# EasyEDA schematic lab6_2020-12-28_17-34-32.json
TITLE: Sheet_1; REV: 1.0; Date: 2020-12-28; Sheet: 1/1; Drawn By: ersinalcinn; Company: Your Company
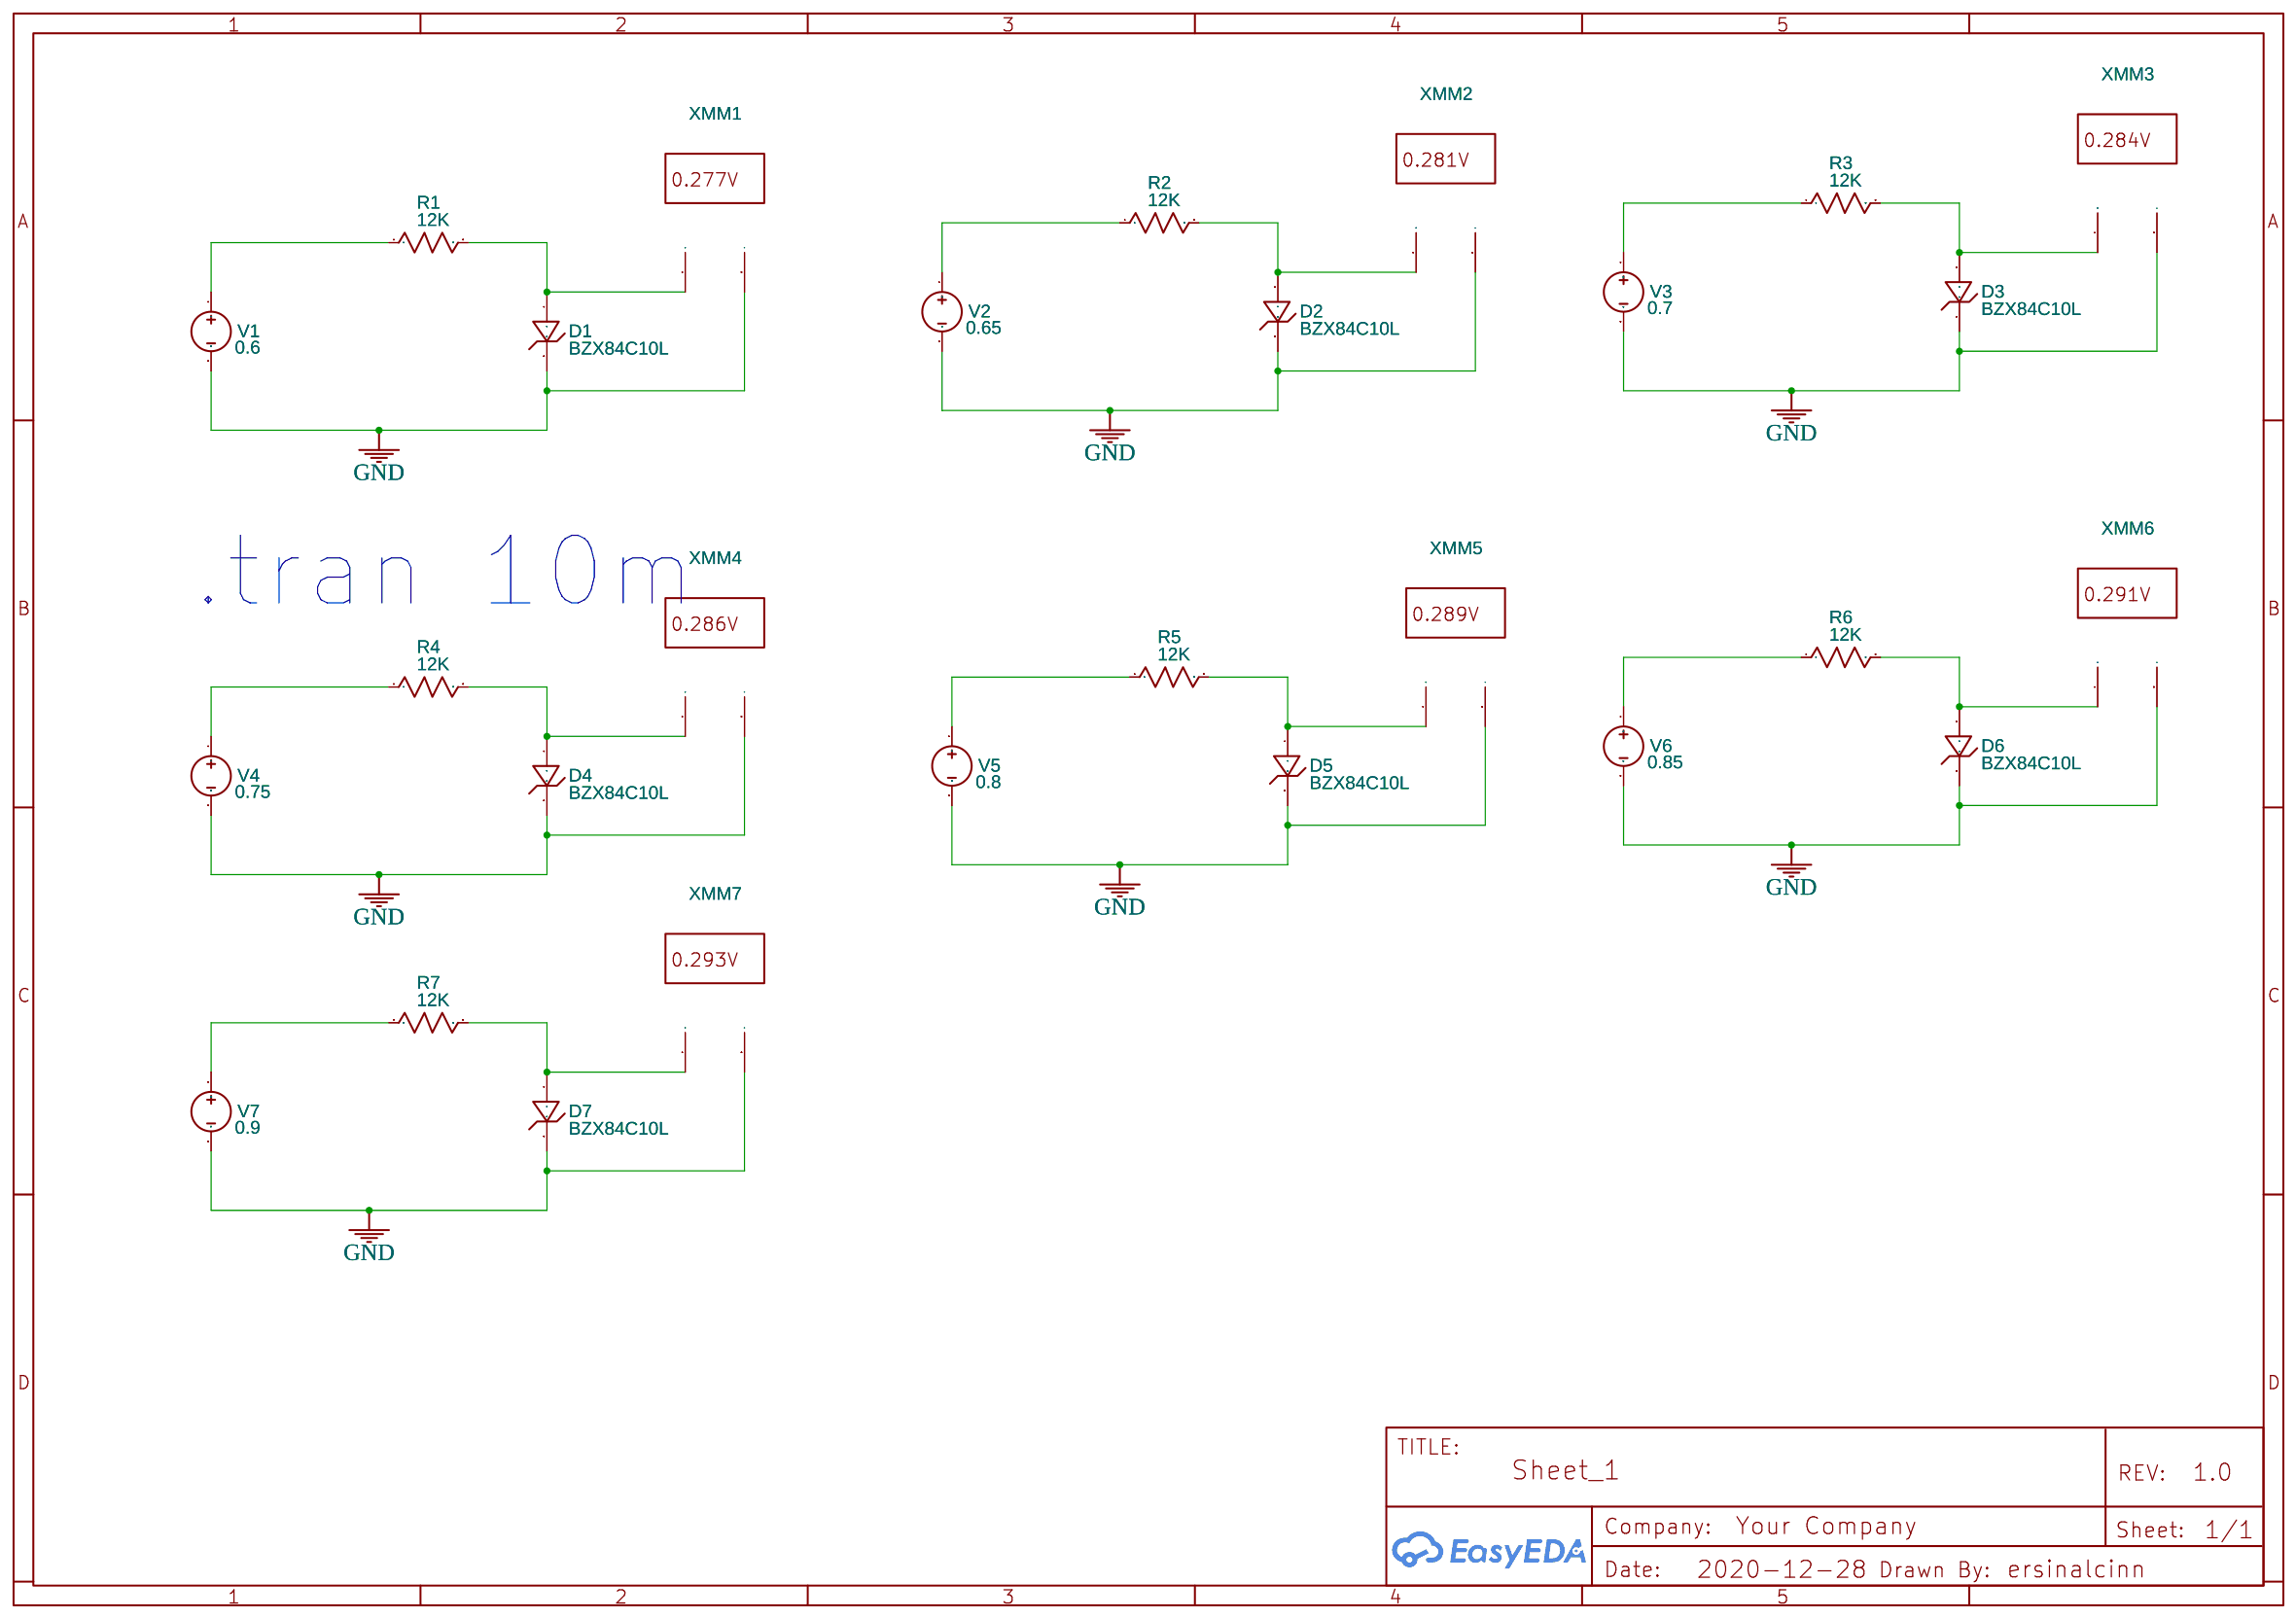
[diagram p0: schematic sheet]

## Parts
D1  BZX84C10L  [SMB]
D2  BZX84C10L  [SMB]
D3  BZX84C10L  [SMB]
D4  BZX84C10L  [SMB]
D5  BZX84C10L  [SMB]
D6  BZX84C10L  [SMB]
D7  BZX84C10L  [SMB]
R1  12K  [AXIAL-0.3]
R2  12K  [AXIAL-0.3]
R3  12K  [AXIAL-0.3]
R4  12K  [AXIAL-0.3]
R5  12K  [AXIAL-0.3]
R6  12K  [AXIAL-0.3]
R7  12K  [AXIAL-0.3]
V1  0.6  [HDR1X2]
V2  0.65  [HDR1X2]
V3  0.7  [HDR1X2]
V4  0.75  [HDR1X2]
V5  0.8  [HDR1X2]
V6  0.85  [HDR1X2]
V7  0.9  [HDR1X2]
XMM1  Multimeter
XMM2  Multimeter
XMM3  Multimeter
XMM4  Multimeter
XMM5  Multimeter
XMM6  Multimeter
XMM7  Multimeter

## Library data of the parts
D1-D7 = BZX84C10L: Contributor: EasyEDA
R1-R7 = Resistor_US: Resistance: 1k; Contributor: EasyEDA; Supplier: YUJING
V1-V7 = VDC: Contributor: EasyEDA; sim: true
XMM1-XMM7 = MULTIMETER: Supplier: LCSC; Multimeter Type: Voltmeter; Power Type: AC; Voltmeter resistance: 10μ; Ammeter resistance: 1G; NameDisplay: 0; Contributor: EasyEDA; sim: true

## Nets
GND: D1.2(K) D2.2(K) D3.2(K) D4.2(K) D5.2(K) D6.2(K) D7.2(K) V1.2 V2.2 V3.2 V4.2 V5.2 V6.2 V7.2 XMM1.2(I) XMM2.2(I) XMM3.2(I) XMM4.2(I) XMM5.2(I) XMM6.2(I) XMM7.2(I)
Net-(D1-1): D1.1(A) R1.2 XMM1.1(+)
Net-(D2-1): D2.1(A) R2.2 XMM2.1(+)
Net-(D3-1): D3.1(A) R3.2 XMM3.1(+)
Net-(D4-1): D4.1(A) R4.2 XMM4.1(+)
Net-(D5-1): D5.1(A) R5.2 XMM5.1(+)
Net-(D6-1): D6.1(A) R6.2 XMM6.1(+)
Net-(D7-1): D7.1(A) R7.2 XMM7.1(+)
Net-(R1-1): R1.1 V1.1
Net-(R2-1): R2.1 V2.1
Net-(R3-1): R3.1 V3.1
Net-(R4-1): R4.1 V4.1
Net-(R5-1): R5.1 V5.1
Net-(R6-1): R6.1 V6.1
Net-(R7-1): R7.1 V7.1

## Notes on the sheet
- .tran 10m
